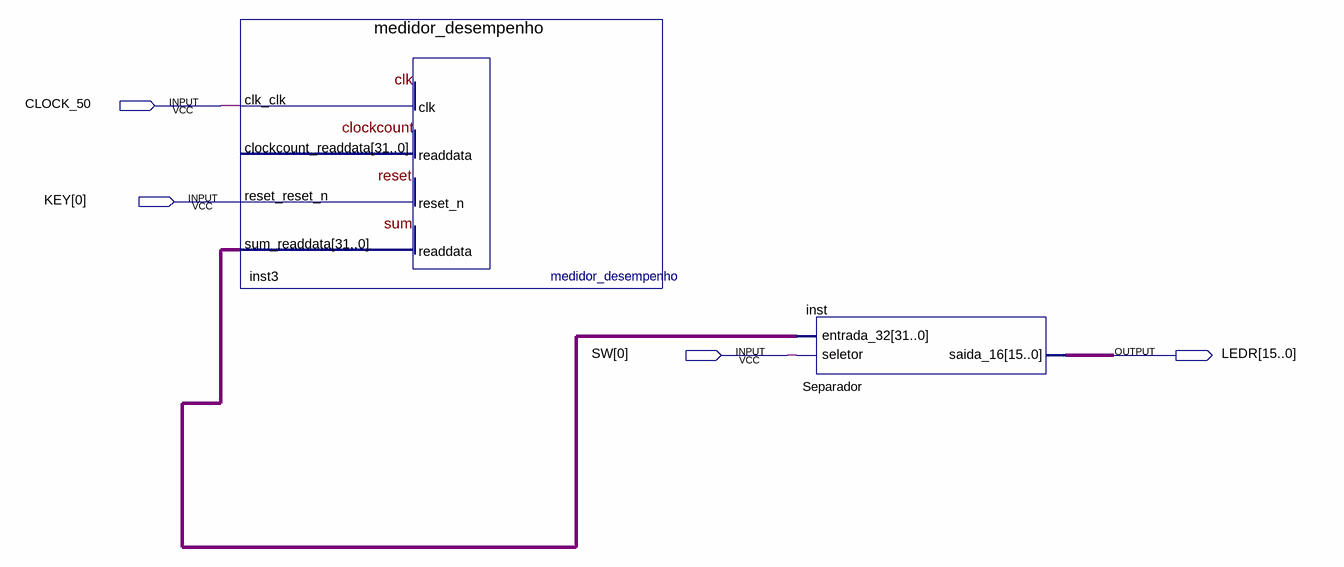
[diagram p0: schematic sheet]
// Quartus schematic Acumulador.bdf as structural Verilog: 2 symbols, 4 pins
module Acumulador (
  input  CLOCK_50,
  input  [0:0] KEY,
  input  [0:0] SW,
  output [15:0] LEDR
);

  wire [31:0] inst3_sum_readdata;

  medidor_desempenho inst3 (
    .clk_clk(CLOCK_50), .reset_reset_n(KEY[0]), .sum_readdata(inst3_sum_readdata));  // open: clockcount_readdata
  Separador inst (.seletor(SW[0]), .entrada_32(inst3_sum_readdata), .saida_16(LEDR));
endmodule
